# EAGLE schematic AD5933_Breakout (EAGLE 6.5.0)
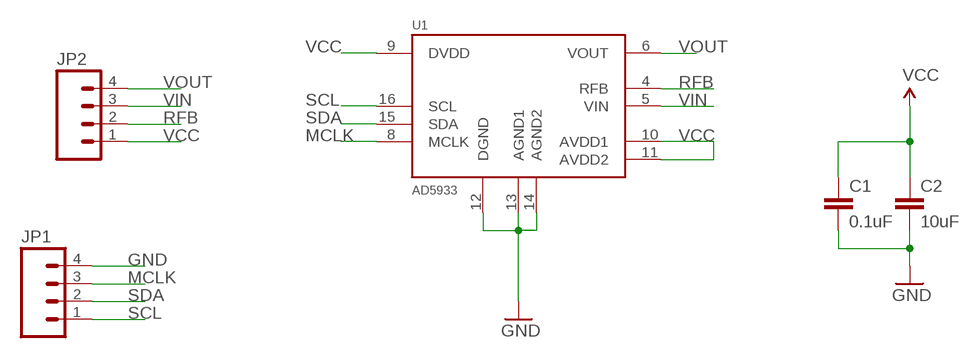
[diagram p0: schematic, sheet 1]

## Parts
C1  0.1uF  0.1UF-100V-10%(0603)  [0603-CAP]
C2  10uF  0.1UF-100V-10%(0603)  [0603-CAP]
JP1  M04PTH  [1X04]
JP2  M04PTH  [1X04]
U1  AD5933  [SSOP16]

## Nets
GND: C1.2 C2.2 JP1.4 U1.12(DGND) U1.13(AGND1) U1.14(AGND2)
MCLK: JP1.3 U1.8(MCLK)
RFB: JP2.2 U1.4(RFB)
SCL: JP1.1 U1.16(SCL)
SDA: JP1.2 U1.15(SDA)
VCC: C1.1 C2.1 JP2.1 U1.9(DVDD) U1.10(AVDD1) U1.11(AVDD2)
VIN: JP2.3 U1.5(VIN)
VOUT: JP2.4 U1.6(VOUT)

## Library data of the parts
C1 = SparkFun-Capacitors:0.1UF-100V-10%(0603): CAP-08390; PROD_ID: CAP-08390
C2 = SparkFun-Capacitors:0.1UF-100V-10%(0603): CAP-08390; PROD_ID: CAP-08390; VALUE: 0.1uF
JP1 JP2 = SparkFun-Connectors:M04: Header 4 Standard 4-pin 0.1" header. Use with straight break away headers (SKU : PRT-00116), right angle break away headers (PRT-00553), swiss pins (PRT-00743), machine pins (PRT-00117), and female headers (PRT-00115). Molex polarized connector foot print use with SKU : PRT-08231 with associated crimp pins and housings. 1MM SMD Version SKU: PRT-10208
U1 = kblom:AD5933: 1 MSPS, 12-Bit Impedance Converter, Network Analyzer Applications: Electrochemical analysis Bioelectrical impedance analysis Impedance spectroscopy Complex impedance measurement Corrosion monitoring and protection equipment Biomedical and automotive sensors Proximity sensing Nondestructive testing Material property analysis Fuel/battery cell condition monitoring source <http://www.analog.com/static/imported-files/data_sheets/AD5933.pdf>